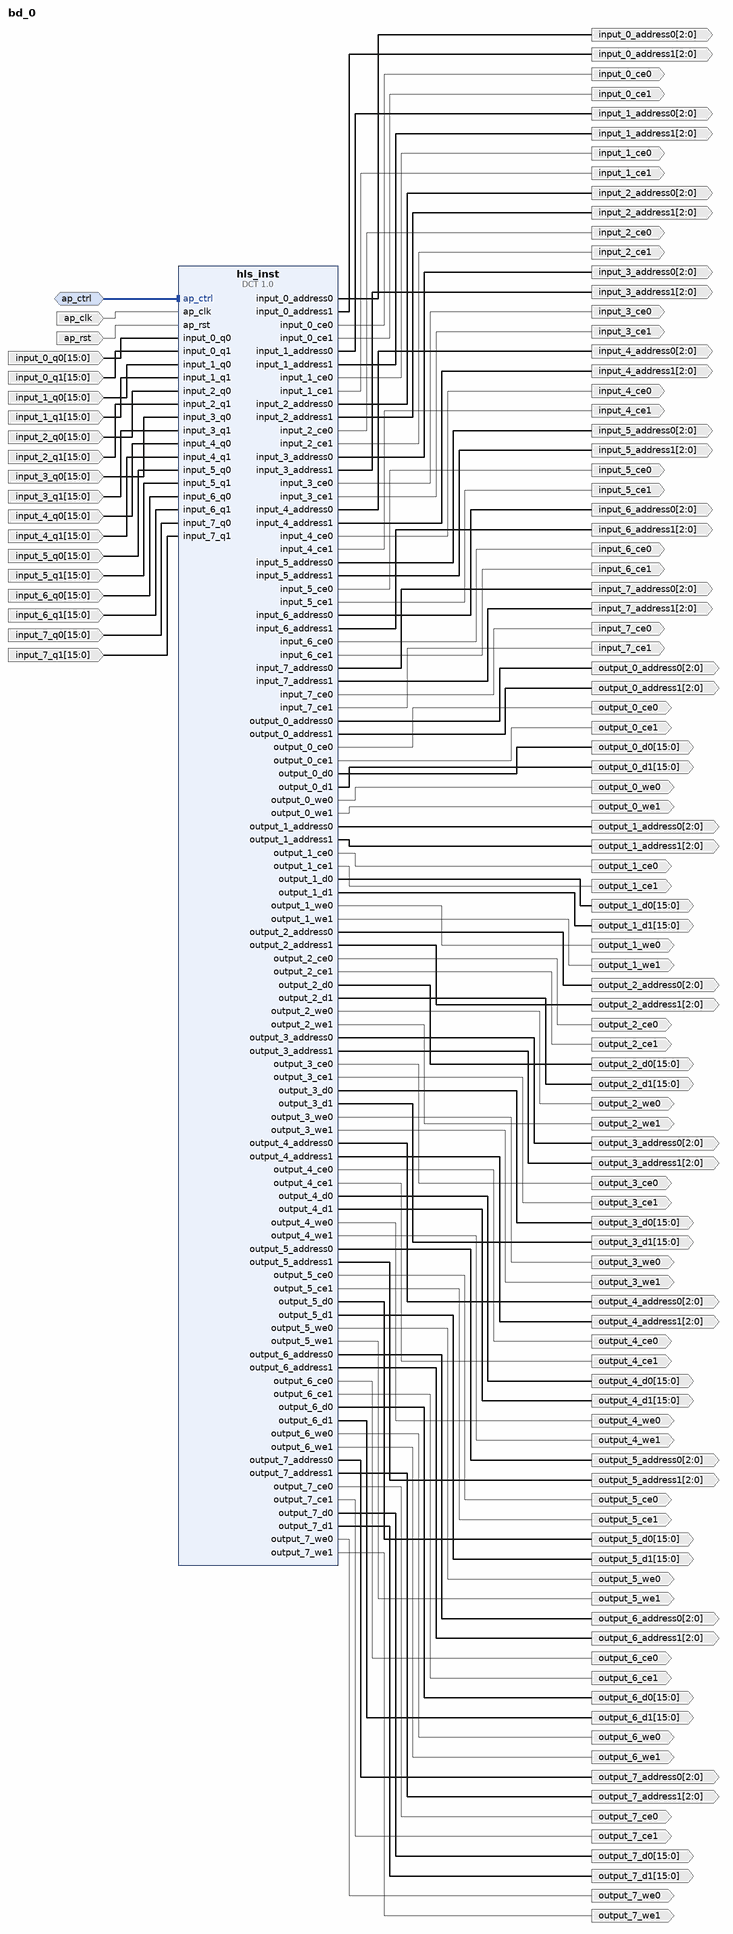
[diagram p0: block diagram of the top level]
# Vivado block design bd_0, xcvu47p-fsvh2892-3-e, Vivado 2019.2
create_bd_design bd_0

create_bd_intf_port -mode Slave -vlnv xilinx.com:interface:acc_handshake_rtl:1.0 ap_ctrl
create_bd_port -dir I -type clk ap_clk
set_property -dict {CONFIG.FREQ_HZ 100000000.0} [get_bd_ports ap_clk]
create_bd_port -dir I -type rst ap_rst
set_property -dict {CONFIG.POLARITY ACTIVE_HIGH} [get_bd_ports ap_rst]
create_bd_port -dir O -from 2 -to 0 -type data input_0_address0
create_bd_port -dir O -from 2 -to 0 -type data input_0_address1
create_bd_port -dir O input_0_ce0
create_bd_port -dir O input_0_ce1
create_bd_port -dir I -from 15 -to 0 -type data input_0_q0
create_bd_port -dir I -from 15 -to 0 -type data input_0_q1
create_bd_port -dir O -from 2 -to 0 -type data input_1_address0
create_bd_port -dir O -from 2 -to 0 -type data input_1_address1
create_bd_port -dir O input_1_ce0
create_bd_port -dir O input_1_ce1
create_bd_port -dir I -from 15 -to 0 -type data input_1_q0
create_bd_port -dir I -from 15 -to 0 -type data input_1_q1
create_bd_port -dir O -from 2 -to 0 -type data input_2_address0
create_bd_port -dir O -from 2 -to 0 -type data input_2_address1
create_bd_port -dir O input_2_ce0
create_bd_port -dir O input_2_ce1
create_bd_port -dir I -from 15 -to 0 -type data input_2_q0
create_bd_port -dir I -from 15 -to 0 -type data input_2_q1
create_bd_port -dir O -from 2 -to 0 -type data input_3_address0
create_bd_port -dir O -from 2 -to 0 -type data input_3_address1
create_bd_port -dir O input_3_ce0
create_bd_port -dir O input_3_ce1
create_bd_port -dir I -from 15 -to 0 -type data input_3_q0
create_bd_port -dir I -from 15 -to 0 -type data input_3_q1
create_bd_port -dir O -from 2 -to 0 -type data input_4_address0
create_bd_port -dir O -from 2 -to 0 -type data input_4_address1
create_bd_port -dir O input_4_ce0
create_bd_port -dir O input_4_ce1
create_bd_port -dir I -from 15 -to 0 -type data input_4_q0
create_bd_port -dir I -from 15 -to 0 -type data input_4_q1
create_bd_port -dir O -from 2 -to 0 -type data input_5_address0
create_bd_port -dir O -from 2 -to 0 -type data input_5_address1
create_bd_port -dir O input_5_ce0
create_bd_port -dir O input_5_ce1
create_bd_port -dir I -from 15 -to 0 -type data input_5_q0
create_bd_port -dir I -from 15 -to 0 -type data input_5_q1
create_bd_port -dir O -from 2 -to 0 -type data input_6_address0
create_bd_port -dir O -from 2 -to 0 -type data input_6_address1
create_bd_port -dir O input_6_ce0
create_bd_port -dir O input_6_ce1
create_bd_port -dir I -from 15 -to 0 -type data input_6_q0
create_bd_port -dir I -from 15 -to 0 -type data input_6_q1
create_bd_port -dir O -from 2 -to 0 -type data input_7_address0
create_bd_port -dir O -from 2 -to 0 -type data input_7_address1
create_bd_port -dir O input_7_ce0
create_bd_port -dir O input_7_ce1
create_bd_port -dir I -from 15 -to 0 -type data input_7_q0
create_bd_port -dir I -from 15 -to 0 -type data input_7_q1
create_bd_port -dir O -from 2 -to 0 -type data output_0_address0
create_bd_port -dir O -from 2 -to 0 -type data output_0_address1
create_bd_port -dir O output_0_ce0
create_bd_port -dir O output_0_ce1
create_bd_port -dir O -from 15 -to 0 -type data output_0_d0
create_bd_port -dir O -from 15 -to 0 -type data output_0_d1
create_bd_port -dir O output_0_we0
create_bd_port -dir O output_0_we1
create_bd_port -dir O -from 2 -to 0 -type data output_1_address0
create_bd_port -dir O -from 2 -to 0 -type data output_1_address1
create_bd_port -dir O output_1_ce0
create_bd_port -dir O output_1_ce1
create_bd_port -dir O -from 15 -to 0 -type data output_1_d0
create_bd_port -dir O -from 15 -to 0 -type data output_1_d1
create_bd_port -dir O output_1_we0
create_bd_port -dir O output_1_we1
create_bd_port -dir O -from 2 -to 0 -type data output_2_address0
create_bd_port -dir O -from 2 -to 0 -type data output_2_address1
create_bd_port -dir O output_2_ce0
create_bd_port -dir O output_2_ce1
create_bd_port -dir O -from 15 -to 0 -type data output_2_d0
create_bd_port -dir O -from 15 -to 0 -type data output_2_d1
create_bd_port -dir O output_2_we0
create_bd_port -dir O output_2_we1
create_bd_port -dir O -from 2 -to 0 -type data output_3_address0
create_bd_port -dir O -from 2 -to 0 -type data output_3_address1
create_bd_port -dir O output_3_ce0
create_bd_port -dir O output_3_ce1
create_bd_port -dir O -from 15 -to 0 -type data output_3_d0
create_bd_port -dir O -from 15 -to 0 -type data output_3_d1
create_bd_port -dir O output_3_we0
create_bd_port -dir O output_3_we1
create_bd_port -dir O -from 2 -to 0 -type data output_4_address0
create_bd_port -dir O -from 2 -to 0 -type data output_4_address1
create_bd_port -dir O output_4_ce0
create_bd_port -dir O output_4_ce1
create_bd_port -dir O -from 15 -to 0 -type data output_4_d0
create_bd_port -dir O -from 15 -to 0 -type data output_4_d1
create_bd_port -dir O output_4_we0
create_bd_port -dir O output_4_we1
create_bd_port -dir O -from 2 -to 0 -type data output_5_address0
create_bd_port -dir O -from 2 -to 0 -type data output_5_address1
create_bd_port -dir O output_5_ce0
create_bd_port -dir O output_5_ce1
create_bd_port -dir O -from 15 -to 0 -type data output_5_d0
create_bd_port -dir O -from 15 -to 0 -type data output_5_d1
create_bd_port -dir O output_5_we0
create_bd_port -dir O output_5_we1
create_bd_port -dir O -from 2 -to 0 -type data output_6_address0
create_bd_port -dir O -from 2 -to 0 -type data output_6_address1
create_bd_port -dir O output_6_ce0
create_bd_port -dir O output_6_ce1
create_bd_port -dir O -from 15 -to 0 -type data output_6_d0
create_bd_port -dir O -from 15 -to 0 -type data output_6_d1
create_bd_port -dir O output_6_we0
create_bd_port -dir O output_6_we1
create_bd_port -dir O -from 2 -to 0 -type data output_7_address0
create_bd_port -dir O -from 2 -to 0 -type data output_7_address1
create_bd_port -dir O output_7_ce0
create_bd_port -dir O output_7_ce1
create_bd_port -dir O -from 15 -to 0 -type data output_7_d0
create_bd_port -dir O -from 15 -to 0 -type data output_7_d1
create_bd_port -dir O output_7_we0
create_bd_port -dir O output_7_we1

create_bd_cell -type ip -vlnv xilinx.com:hls:DCT:1.0 hls_inst

# ---- connections ----

connect_bd_intf_net -intf_net ap_ctrl_0_1 [get_bd_intf_ports ap_ctrl] [get_bd_intf_pins hls_inst/ap_ctrl]
connect_bd_net -net ap_clk_0_1 [get_bd_ports ap_clk] [get_bd_pins hls_inst/ap_clk]
connect_bd_net -net ap_rst_0_1 [get_bd_ports ap_rst] [get_bd_pins hls_inst/ap_rst]
connect_bd_net [get_bd_pins hls_inst/input_0_address0] [get_bd_ports input_0_address0]
connect_bd_net [get_bd_pins hls_inst/input_0_address1] [get_bd_ports input_0_address1]
connect_bd_net [get_bd_pins hls_inst/input_0_ce0] [get_bd_ports input_0_ce0]
connect_bd_net [get_bd_pins hls_inst/input_0_ce1] [get_bd_ports input_0_ce1]
connect_bd_net -net input_0_q0_0_1 [get_bd_ports input_0_q0] [get_bd_pins hls_inst/input_0_q0]
connect_bd_net -net input_0_q1_0_1 [get_bd_ports input_0_q1] [get_bd_pins hls_inst/input_0_q1]
connect_bd_net [get_bd_pins hls_inst/input_1_address0] [get_bd_ports input_1_address0]
connect_bd_net [get_bd_pins hls_inst/input_1_address1] [get_bd_ports input_1_address1]
connect_bd_net [get_bd_pins hls_inst/input_1_ce0] [get_bd_ports input_1_ce0]
connect_bd_net [get_bd_pins hls_inst/input_1_ce1] [get_bd_ports input_1_ce1]
connect_bd_net -net input_1_q0_0_1 [get_bd_ports input_1_q0] [get_bd_pins hls_inst/input_1_q0]
connect_bd_net -net input_1_q1_0_1 [get_bd_ports input_1_q1] [get_bd_pins hls_inst/input_1_q1]
connect_bd_net [get_bd_pins hls_inst/input_2_address0] [get_bd_ports input_2_address0]
connect_bd_net [get_bd_pins hls_inst/input_2_address1] [get_bd_ports input_2_address1]
connect_bd_net [get_bd_pins hls_inst/input_2_ce0] [get_bd_ports input_2_ce0]
connect_bd_net [get_bd_pins hls_inst/input_2_ce1] [get_bd_ports input_2_ce1]
connect_bd_net -net input_2_q0_0_1 [get_bd_ports input_2_q0] [get_bd_pins hls_inst/input_2_q0]
connect_bd_net -net input_2_q1_0_1 [get_bd_ports input_2_q1] [get_bd_pins hls_inst/input_2_q1]
connect_bd_net [get_bd_pins hls_inst/input_3_address0] [get_bd_ports input_3_address0]
connect_bd_net [get_bd_pins hls_inst/input_3_address1] [get_bd_ports input_3_address1]
connect_bd_net [get_bd_pins hls_inst/input_3_ce0] [get_bd_ports input_3_ce0]
connect_bd_net [get_bd_pins hls_inst/input_3_ce1] [get_bd_ports input_3_ce1]
connect_bd_net -net input_3_q0_0_1 [get_bd_ports input_3_q0] [get_bd_pins hls_inst/input_3_q0]
connect_bd_net -net input_3_q1_0_1 [get_bd_ports input_3_q1] [get_bd_pins hls_inst/input_3_q1]
connect_bd_net [get_bd_pins hls_inst/input_4_address0] [get_bd_ports input_4_address0]
connect_bd_net [get_bd_pins hls_inst/input_4_address1] [get_bd_ports input_4_address1]
connect_bd_net [get_bd_pins hls_inst/input_4_ce0] [get_bd_ports input_4_ce0]
connect_bd_net [get_bd_pins hls_inst/input_4_ce1] [get_bd_ports input_4_ce1]
connect_bd_net -net input_4_q0_0_1 [get_bd_ports input_4_q0] [get_bd_pins hls_inst/input_4_q0]
connect_bd_net -net input_4_q1_0_1 [get_bd_ports input_4_q1] [get_bd_pins hls_inst/input_4_q1]
connect_bd_net [get_bd_pins hls_inst/input_5_address0] [get_bd_ports input_5_address0]
connect_bd_net [get_bd_pins hls_inst/input_5_address1] [get_bd_ports input_5_address1]
connect_bd_net [get_bd_pins hls_inst/input_5_ce0] [get_bd_ports input_5_ce0]
connect_bd_net [get_bd_pins hls_inst/input_5_ce1] [get_bd_ports input_5_ce1]
connect_bd_net -net input_5_q0_0_1 [get_bd_ports input_5_q0] [get_bd_pins hls_inst/input_5_q0]
connect_bd_net -net input_5_q1_0_1 [get_bd_ports input_5_q1] [get_bd_pins hls_inst/input_5_q1]
connect_bd_net [get_bd_pins hls_inst/input_6_address0] [get_bd_ports input_6_address0]
connect_bd_net [get_bd_pins hls_inst/input_6_address1] [get_bd_ports input_6_address1]
connect_bd_net [get_bd_pins hls_inst/input_6_ce0] [get_bd_ports input_6_ce0]
connect_bd_net [get_bd_pins hls_inst/input_6_ce1] [get_bd_ports input_6_ce1]
connect_bd_net -net input_6_q0_0_1 [get_bd_ports input_6_q0] [get_bd_pins hls_inst/input_6_q0]
connect_bd_net -net input_6_q1_0_1 [get_bd_ports input_6_q1] [get_bd_pins hls_inst/input_6_q1]
connect_bd_net [get_bd_pins hls_inst/input_7_address0] [get_bd_ports input_7_address0]
connect_bd_net [get_bd_pins hls_inst/input_7_address1] [get_bd_ports input_7_address1]
connect_bd_net [get_bd_pins hls_inst/input_7_ce0] [get_bd_ports input_7_ce0]
connect_bd_net [get_bd_pins hls_inst/input_7_ce1] [get_bd_ports input_7_ce1]
connect_bd_net -net input_7_q0_0_1 [get_bd_ports input_7_q0] [get_bd_pins hls_inst/input_7_q0]
connect_bd_net -net input_7_q1_0_1 [get_bd_ports input_7_q1] [get_bd_pins hls_inst/input_7_q1]
connect_bd_net [get_bd_pins hls_inst/output_0_address0] [get_bd_ports output_0_address0]
connect_bd_net [get_bd_pins hls_inst/output_0_address1] [get_bd_ports output_0_address1]
connect_bd_net [get_bd_pins hls_inst/output_0_ce0] [get_bd_ports output_0_ce0]
connect_bd_net [get_bd_pins hls_inst/output_0_ce1] [get_bd_ports output_0_ce1]
connect_bd_net [get_bd_pins hls_inst/output_0_d0] [get_bd_ports output_0_d0]
connect_bd_net [get_bd_pins hls_inst/output_0_d1] [get_bd_ports output_0_d1]
connect_bd_net [get_bd_pins hls_inst/output_0_we0] [get_bd_ports output_0_we0]
connect_bd_net [get_bd_pins hls_inst/output_0_we1] [get_bd_ports output_0_we1]
connect_bd_net [get_bd_pins hls_inst/output_1_address0] [get_bd_ports output_1_address0]
connect_bd_net [get_bd_pins hls_inst/output_1_address1] [get_bd_ports output_1_address1]
connect_bd_net [get_bd_pins hls_inst/output_1_ce0] [get_bd_ports output_1_ce0]
connect_bd_net [get_bd_pins hls_inst/output_1_ce1] [get_bd_ports output_1_ce1]
connect_bd_net [get_bd_pins hls_inst/output_1_d0] [get_bd_ports output_1_d0]
connect_bd_net [get_bd_pins hls_inst/output_1_d1] [get_bd_ports output_1_d1]
connect_bd_net [get_bd_pins hls_inst/output_1_we0] [get_bd_ports output_1_we0]
connect_bd_net [get_bd_pins hls_inst/output_1_we1] [get_bd_ports output_1_we1]
connect_bd_net [get_bd_pins hls_inst/output_2_address0] [get_bd_ports output_2_address0]
connect_bd_net [get_bd_pins hls_inst/output_2_address1] [get_bd_ports output_2_address1]
connect_bd_net [get_bd_pins hls_inst/output_2_ce0] [get_bd_ports output_2_ce0]
connect_bd_net [get_bd_pins hls_inst/output_2_ce1] [get_bd_ports output_2_ce1]
connect_bd_net [get_bd_pins hls_inst/output_2_d0] [get_bd_ports output_2_d0]
connect_bd_net [get_bd_pins hls_inst/output_2_d1] [get_bd_ports output_2_d1]
connect_bd_net [get_bd_pins hls_inst/output_2_we0] [get_bd_ports output_2_we0]
connect_bd_net [get_bd_pins hls_inst/output_2_we1] [get_bd_ports output_2_we1]
connect_bd_net [get_bd_pins hls_inst/output_3_address0] [get_bd_ports output_3_address0]
connect_bd_net [get_bd_pins hls_inst/output_3_address1] [get_bd_ports output_3_address1]
connect_bd_net [get_bd_pins hls_inst/output_3_ce0] [get_bd_ports output_3_ce0]
connect_bd_net [get_bd_pins hls_inst/output_3_ce1] [get_bd_ports output_3_ce1]
connect_bd_net [get_bd_pins hls_inst/output_3_d0] [get_bd_ports output_3_d0]
connect_bd_net [get_bd_pins hls_inst/output_3_d1] [get_bd_ports output_3_d1]
connect_bd_net [get_bd_pins hls_inst/output_3_we0] [get_bd_ports output_3_we0]
connect_bd_net [get_bd_pins hls_inst/output_3_we1] [get_bd_ports output_3_we1]
connect_bd_net [get_bd_pins hls_inst/output_4_address0] [get_bd_ports output_4_address0]
connect_bd_net [get_bd_pins hls_inst/output_4_address1] [get_bd_ports output_4_address1]
connect_bd_net [get_bd_pins hls_inst/output_4_ce0] [get_bd_ports output_4_ce0]
connect_bd_net [get_bd_pins hls_inst/output_4_ce1] [get_bd_ports output_4_ce1]
connect_bd_net [get_bd_pins hls_inst/output_4_d0] [get_bd_ports output_4_d0]
connect_bd_net [get_bd_pins hls_inst/output_4_d1] [get_bd_ports output_4_d1]
connect_bd_net [get_bd_pins hls_inst/output_4_we0] [get_bd_ports output_4_we0]
connect_bd_net [get_bd_pins hls_inst/output_4_we1] [get_bd_ports output_4_we1]
connect_bd_net [get_bd_pins hls_inst/output_5_address0] [get_bd_ports output_5_address0]
connect_bd_net [get_bd_pins hls_inst/output_5_address1] [get_bd_ports output_5_address1]
connect_bd_net [get_bd_pins hls_inst/output_5_ce0] [get_bd_ports output_5_ce0]
connect_bd_net [get_bd_pins hls_inst/output_5_ce1] [get_bd_ports output_5_ce1]
connect_bd_net [get_bd_pins hls_inst/output_5_d0] [get_bd_ports output_5_d0]
connect_bd_net [get_bd_pins hls_inst/output_5_d1] [get_bd_ports output_5_d1]
connect_bd_net [get_bd_pins hls_inst/output_5_we0] [get_bd_ports output_5_we0]
connect_bd_net [get_bd_pins hls_inst/output_5_we1] [get_bd_ports output_5_we1]
connect_bd_net [get_bd_pins hls_inst/output_6_address0] [get_bd_ports output_6_address0]
connect_bd_net [get_bd_pins hls_inst/output_6_address1] [get_bd_ports output_6_address1]
connect_bd_net [get_bd_pins hls_inst/output_6_ce0] [get_bd_ports output_6_ce0]
connect_bd_net [get_bd_pins hls_inst/output_6_ce1] [get_bd_ports output_6_ce1]
connect_bd_net [get_bd_pins hls_inst/output_6_d0] [get_bd_ports output_6_d0]
connect_bd_net [get_bd_pins hls_inst/output_6_d1] [get_bd_ports output_6_d1]
connect_bd_net [get_bd_pins hls_inst/output_6_we0] [get_bd_ports output_6_we0]
connect_bd_net [get_bd_pins hls_inst/output_6_we1] [get_bd_ports output_6_we1]
connect_bd_net [get_bd_pins hls_inst/output_7_address0] [get_bd_ports output_7_address0]
connect_bd_net [get_bd_pins hls_inst/output_7_address1] [get_bd_ports output_7_address1]
connect_bd_net [get_bd_pins hls_inst/output_7_ce0] [get_bd_ports output_7_ce0]
connect_bd_net [get_bd_pins hls_inst/output_7_ce1] [get_bd_ports output_7_ce1]
connect_bd_net [get_bd_pins hls_inst/output_7_d0] [get_bd_ports output_7_d0]
connect_bd_net [get_bd_pins hls_inst/output_7_d1] [get_bd_ports output_7_d1]
connect_bd_net [get_bd_pins hls_inst/output_7_we0] [get_bd_ports output_7_we0]
connect_bd_net [get_bd_pins hls_inst/output_7_we1] [get_bd_ports output_7_we1]

validate_bd_design
save_bd_design
